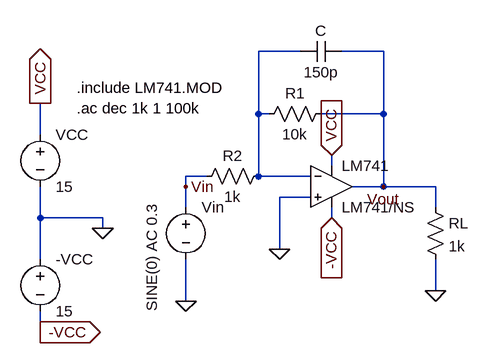
[diagram p0: schematic lab6task1.asc]
lab6task1.asc, the LTspice schematic file:
Version 4
SHEET 1 880 680
WIRE 304 128 240 128
WIRE 432 128 368 128
WIRE 240 224 240 128
WIRE 256 224 240 224
WIRE 432 224 432 128
WIRE 432 224 336 224
WIRE -96 256 -96 208
WIRE 352 304 352 288
WIRE 160 320 128 320
WIRE 240 320 240 224
WIRE 320 320 240 320
WIRE 128 336 128 320
WIRE 432 336 432 224
WIRE 432 336 384 336
WIRE 512 336 432 336
WIRE 320 352 272 352
WIRE 128 368 128 336
WIRE 512 368 512 336
WIRE -96 384 -96 336
WIRE 0 384 -96 384
WIRE 352 384 352 368
WIRE 0 400 0 384
WIRE 272 432 272 352
WIRE -96 448 -96 384
WIRE 512 496 512 448
WIRE 128 512 128 448
WIRE -96 560 -96 528
WIRE -96 576 -96 560
FLAG 0 400 0
FLAG 272 432 0
FLAG 512 496 0
FLAG 128 512 0
FLAG -96 208 VCC
IOPIN -96 208 Out
FLAG -96 560 -VCC
IOPIN -96 560 Out
FLAG 352 288 VCC
IOPIN 352 288 In
FLAG 352 384 -VCC
IOPIN 352 384 In
FLAG 128 336 Vin
FLAG 432 336 Vout
SYMBOL OpAmps/opamp2 352 272 R0
SYMATTR InstName LM741
SYMATTR Value LM741/NS
SYMBOL Voltage -96 240 R0
SYMATTR InstName VCC
SYMATTR Value 15
SYMBOL Voltage -96 432 R0
SYMATTR InstName -VCC
SYMATTR Value 15
SYMBOL Res 352 208 R90
WINDOW 0 0 56 VBottom 2
WINDOW 3 32 56 VTop 2
SYMATTR InstName R1
SYMATTR Value 10k
SYMBOL Res 256 304 R90
WINDOW 0 0 56 VBottom 2
WINDOW 3 32 56 VTop 2
SYMATTR InstName R2
SYMATTR Value 1k
SYMBOL Voltage 128 352 R0
WINDOW 3 -52 10 VRight 2
SYMATTR Value SINE(0) AC 0.3
SYMATTR InstName Vin
SYMBOL Res 496 352 R0
SYMATTR InstName RL
SYMATTR Value 1k
SYMBOL Cap 368 112 R90
WINDOW 0 0 32 VBottom 2
WINDOW 3 32 32 VTop 2
SYMATTR InstName C
SYMATTR Value 150p
TEXT -40 184 Left 2 !.include LM741.MOD\n.ac dec 1k 1 100k

The netlist it stands for:
* lab6task1.asc
XLM741 0 N001 VCC -VCC Vout LM741/NS  ; pins In+ In- V+ V- OUT
VCC VCC 0 15
V§-VCC 0 -VCC 15
R1 Vout N001 10k
R2 N001 Vin 1k
Vin Vin 0 SINE(0) AC 0.3
RL Vout 0 1k
C Vout N001 150p
.include LM741.MOD
.ac dec 1k 1 100k
.backanno
.end